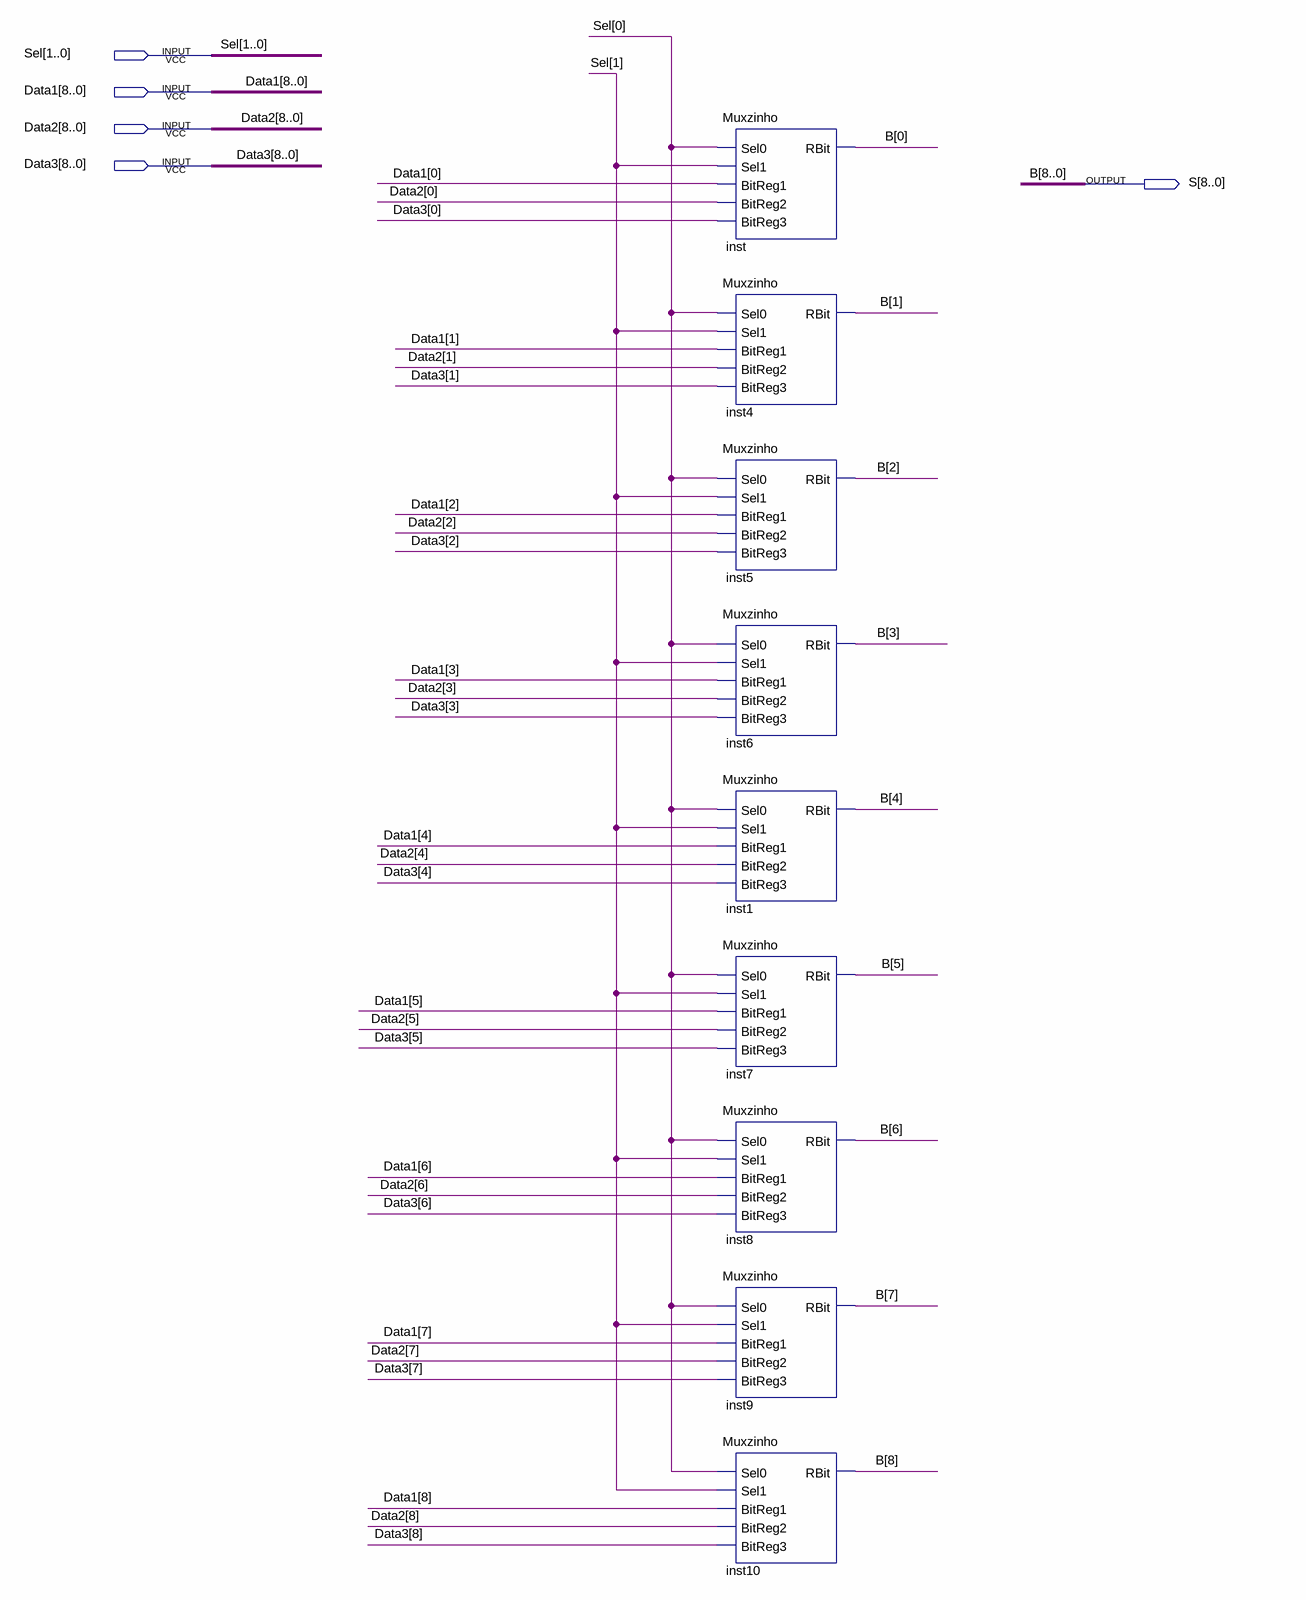
[diagram p0: schematic sheet]
// Quartus schematic 3x9bitMux.bdf as structural Verilog: 9 symbols, 5 pins
module \3x9bitMux  (
  input  [1:0] Sel,
  input  [8:0] Data1,
  input  [8:0] Data2,
  input  [8:0] Data3,
  output [8:0] S
);

  Muxzinho inst (.Sel1(Sel[1]), .Sel0(Sel[0]), .BitReg1(Data1[0]), .BitReg2(Data2[0]), .BitReg3(Data3[0]), .RBit(S[0]));
  Muxzinho inst4 (
    .Sel1(Sel[1]), .Sel0(Sel[0]), .BitReg1(Data1[1]), .BitReg2(Data2[1]), .BitReg3(Data3[1]), .RBit(S[1]));
  Muxzinho inst5 (
    .Sel1(Sel[1]), .Sel0(Sel[0]), .BitReg1(Data1[2]), .BitReg2(Data2[2]), .BitReg3(Data3[2]), .RBit(S[2]));
  Muxzinho inst6 (
    .Sel1(Sel[1]), .Sel0(Sel[0]), .BitReg1(Data1[3]), .BitReg2(Data2[3]), .BitReg3(Data3[3]), .RBit(S[3]));
  Muxzinho inst1 (
    .Sel1(Sel[1]), .Sel0(Sel[0]), .BitReg1(Data1[4]), .BitReg2(Data2[4]), .BitReg3(Data3[4]), .RBit(S[4]));
  Muxzinho inst7 (
    .Sel1(Sel[1]), .Sel0(Sel[0]), .BitReg1(Data1[5]), .BitReg2(Data2[5]), .BitReg3(Data3[5]), .RBit(S[5]));
  Muxzinho inst8 (
    .Sel1(Sel[1]), .Sel0(Sel[0]), .BitReg1(Data1[6]), .BitReg2(Data2[6]), .BitReg3(Data3[6]), .RBit(S[6]));
  Muxzinho inst9 (
    .Sel1(Sel[1]), .Sel0(Sel[0]), .BitReg1(Data1[7]), .BitReg2(Data2[7]), .BitReg3(Data3[7]), .RBit(S[7]));
  Muxzinho inst10 (
    .Sel1(Sel[1]), .Sel0(Sel[0]), .BitReg1(Data1[8]), .BitReg2(Data2[8]), .BitReg3(Data3[8]), .RBit(S[8]));

  // Other names for the same wires on the sheet: B[8:0] = S
endmodule
